# EasyEDA schematic soap-disp-mega.json

## Sheets
1 Power: TITLE: Sheet_2; REV: 1.0; Date: 2021-03-28; Sheet: 1/1; Drawn By: Suresh Kumar Gadi; Company: Your Company
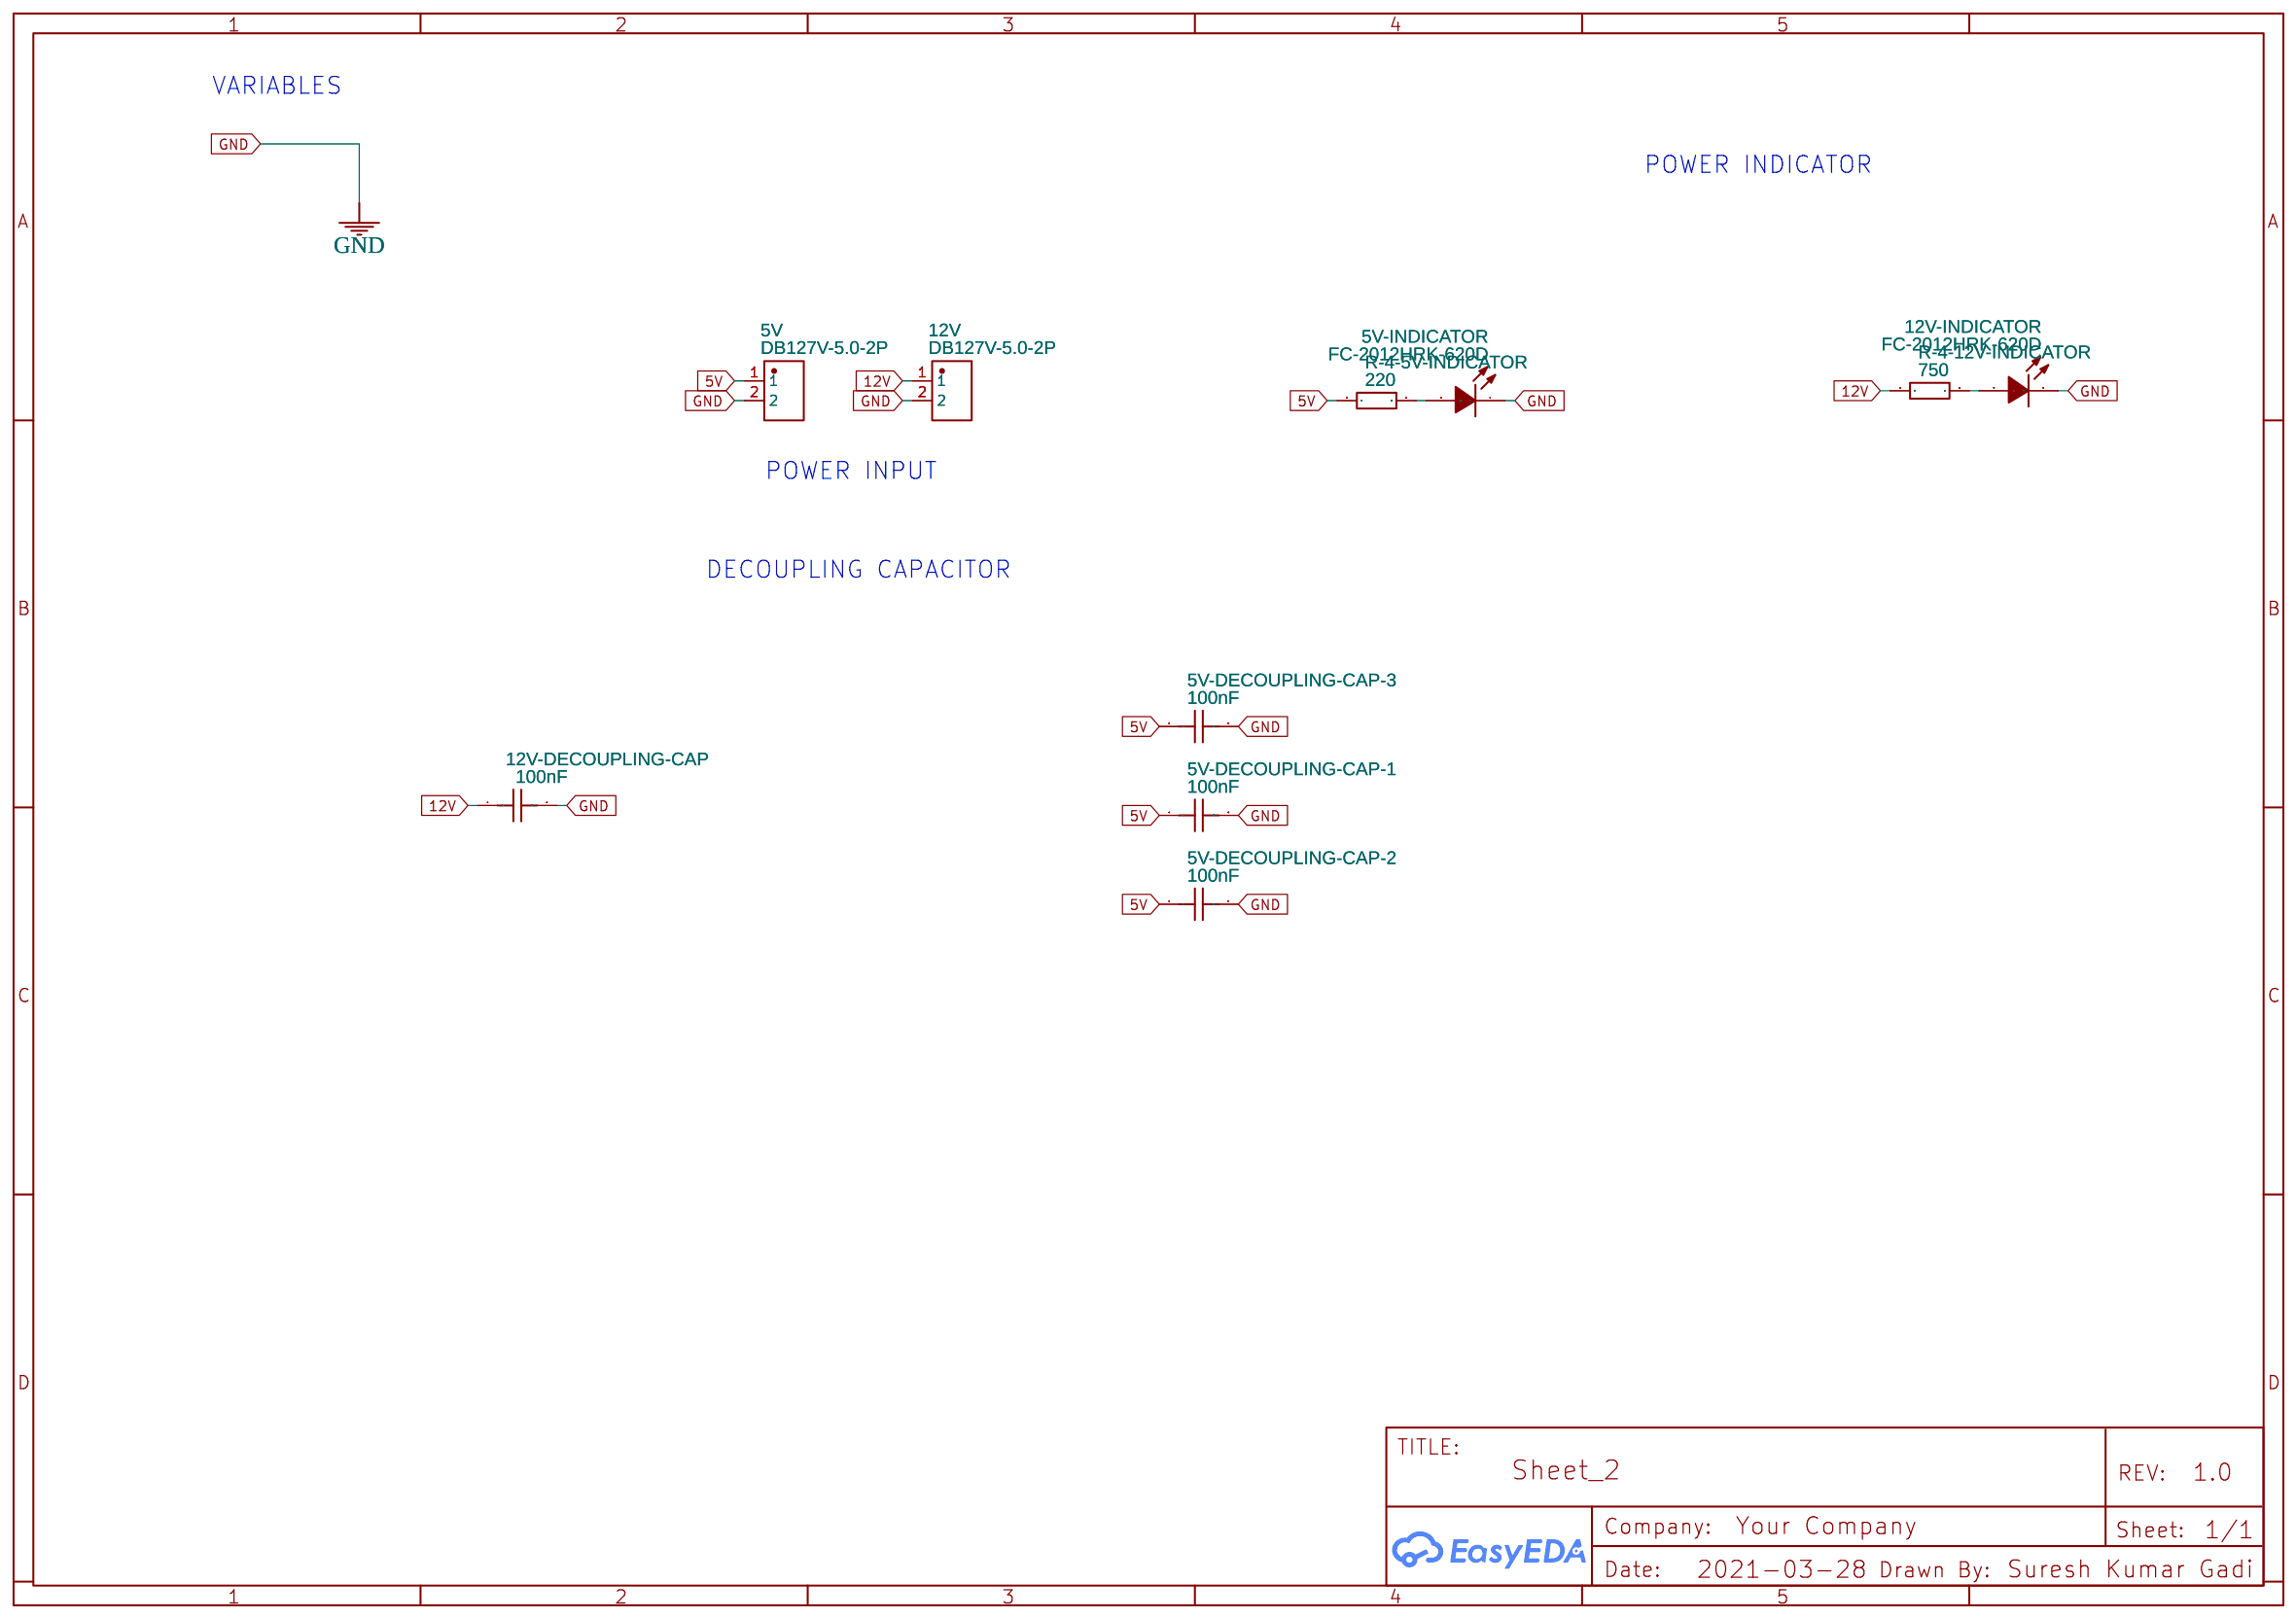
[diagram p0: Power]
2 Computer: TITLE: Sheet_1; Date: 2021-04-07
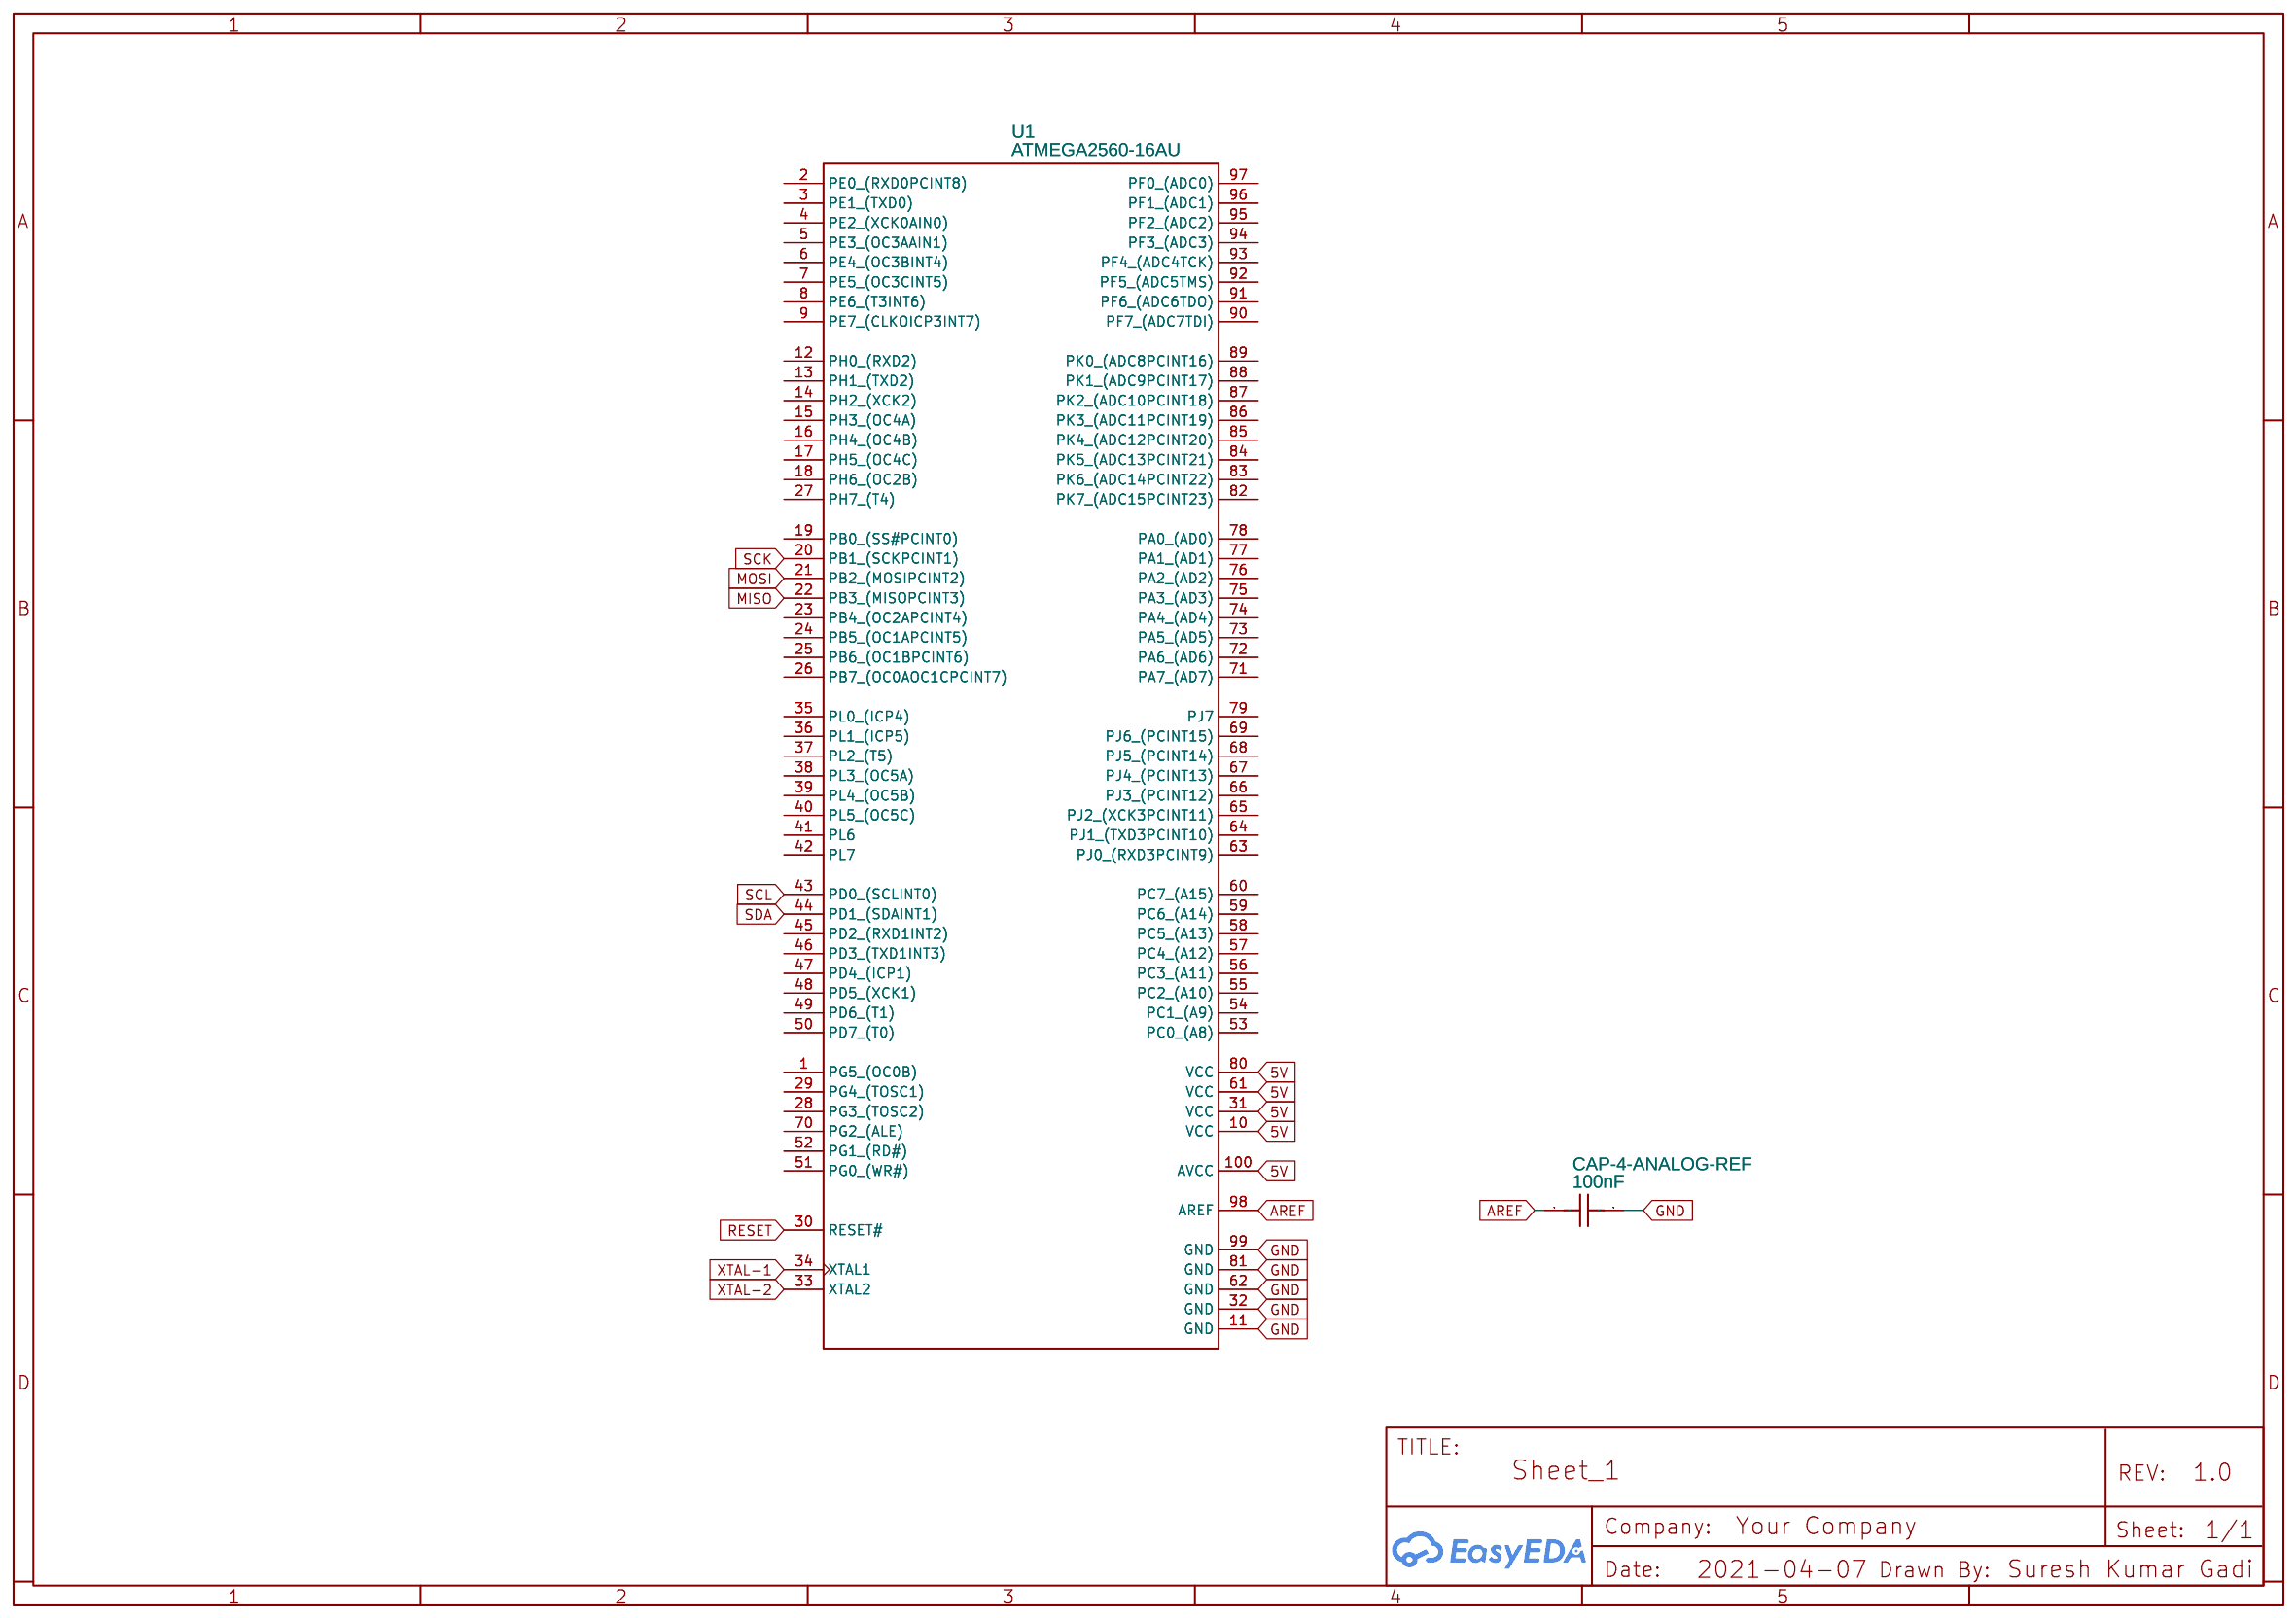
[diagram p1: Computer]
3 Crystal: TITLE: Sheet_1; Date: 2021-04-07
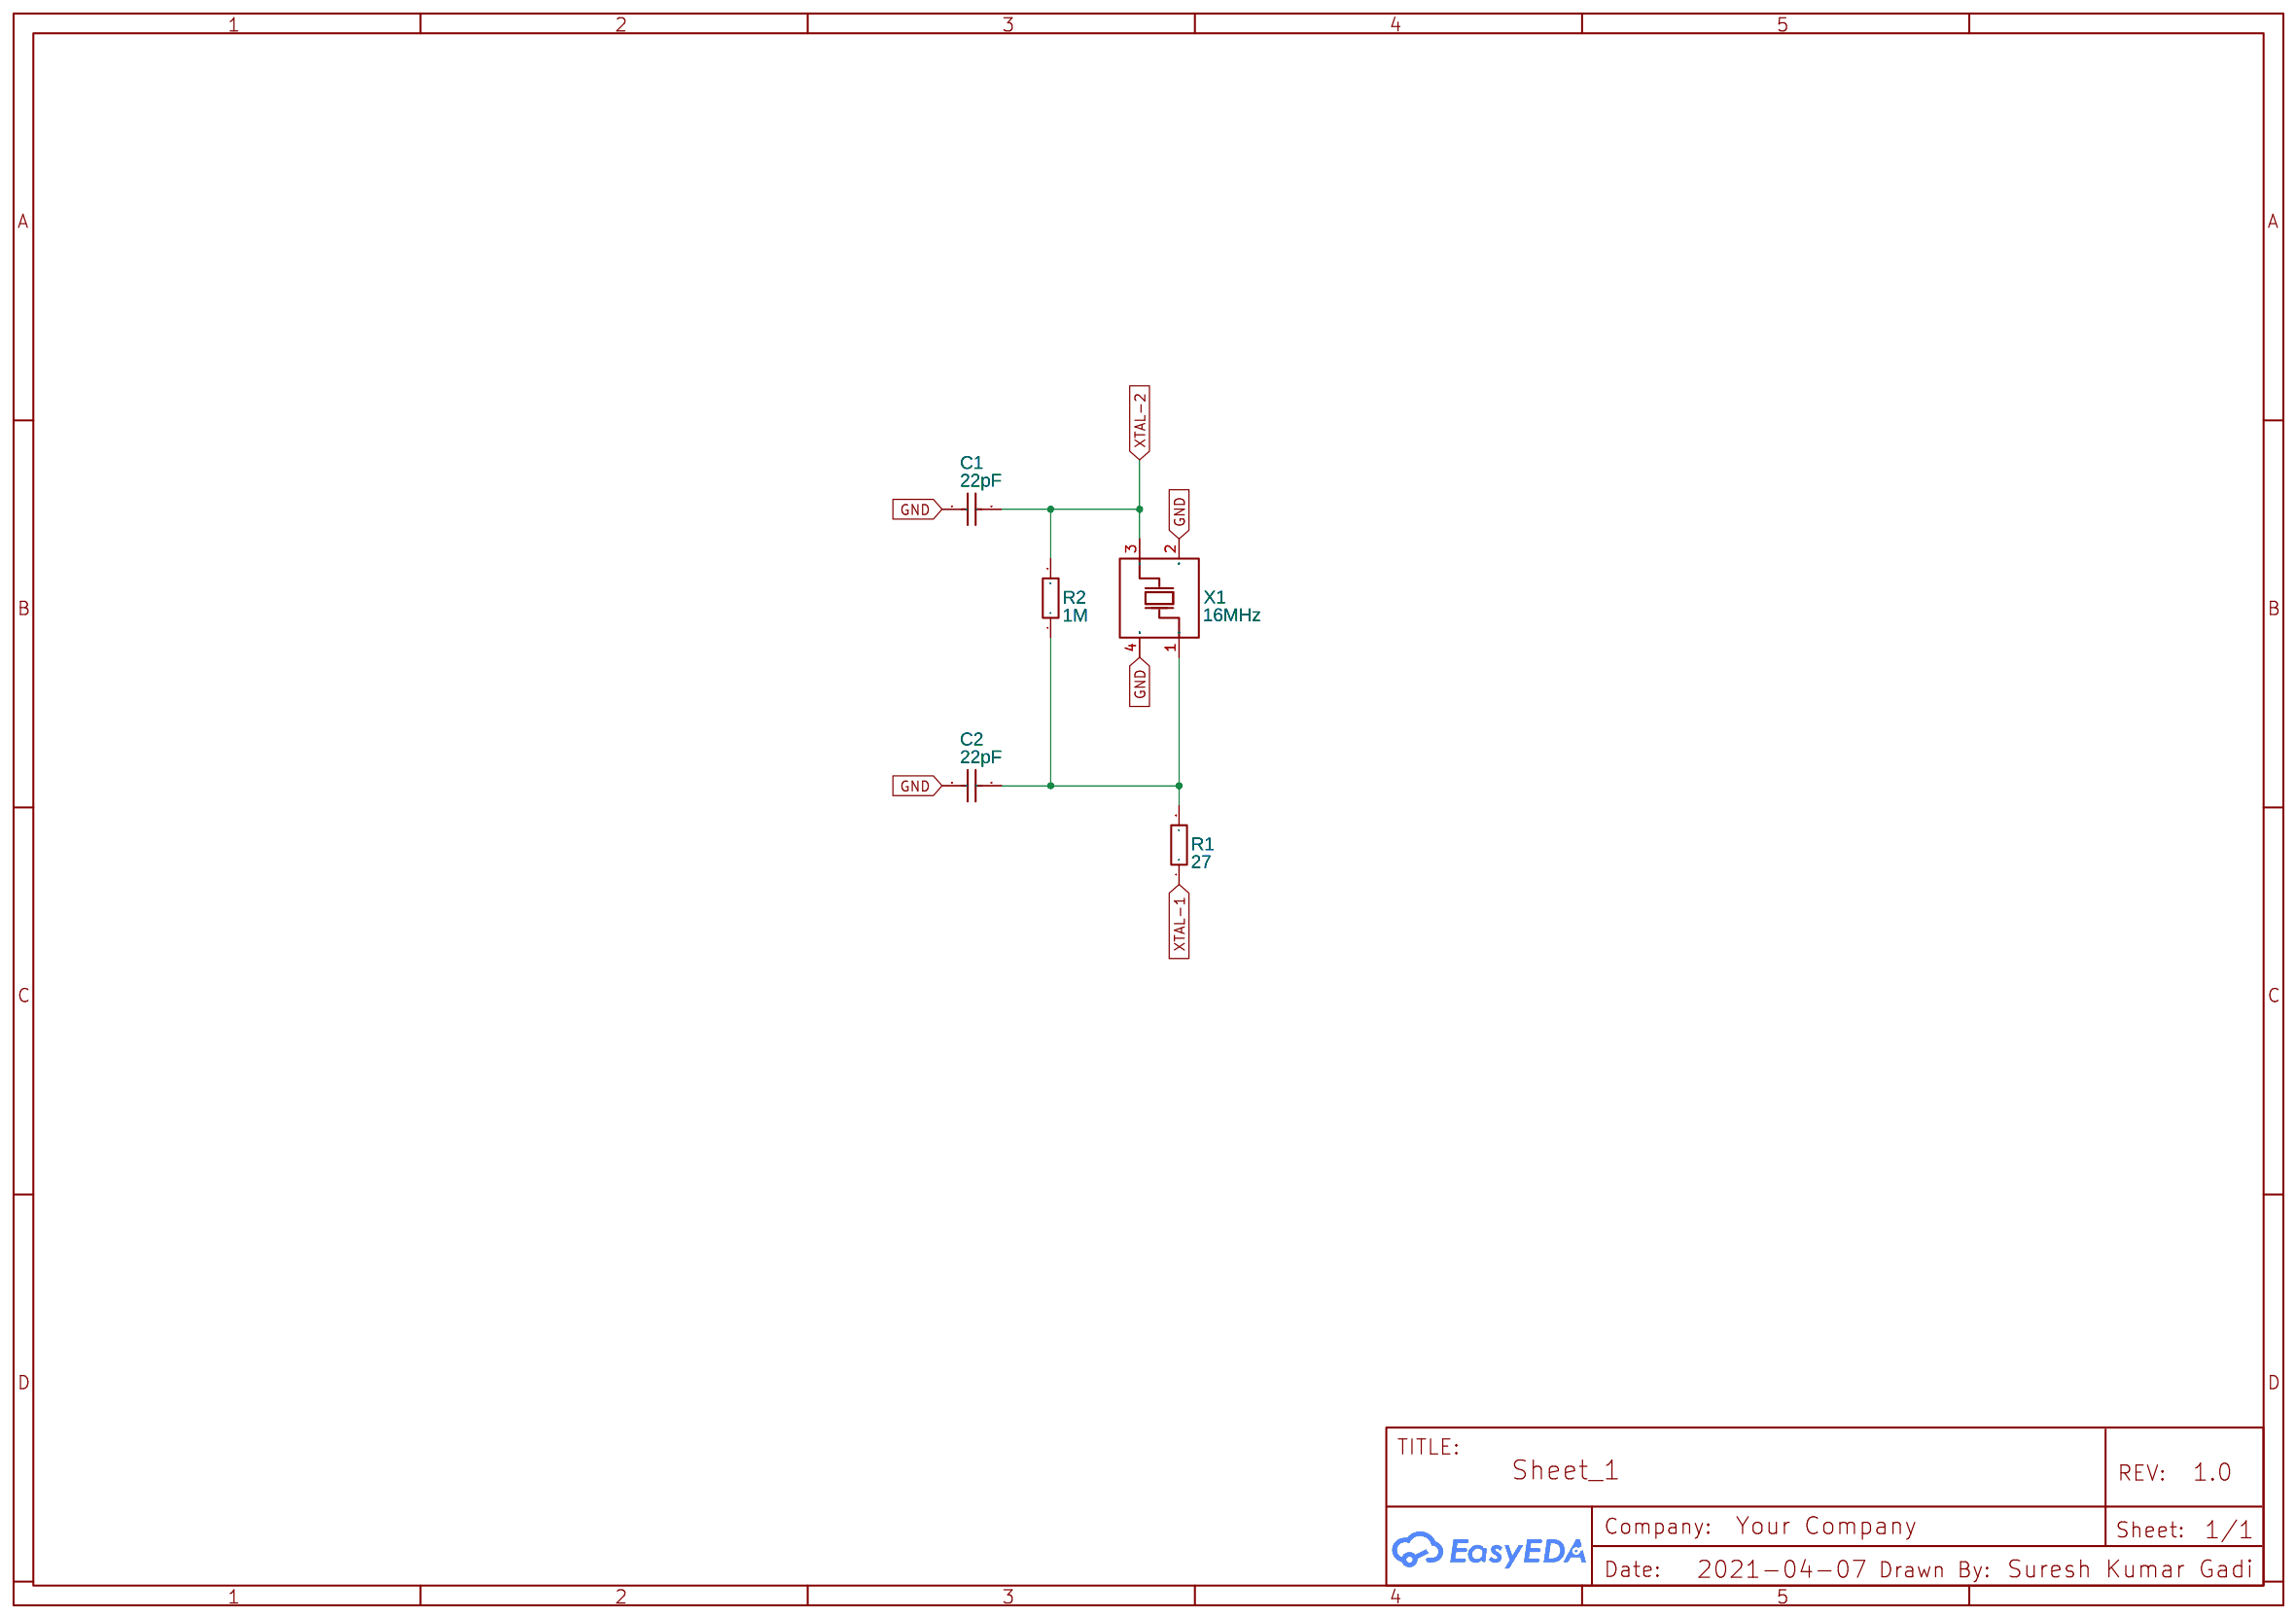
[diagram p2: Crystal]
4 ICSP: TITLE: Sheet_1; Date: 2021-04-07
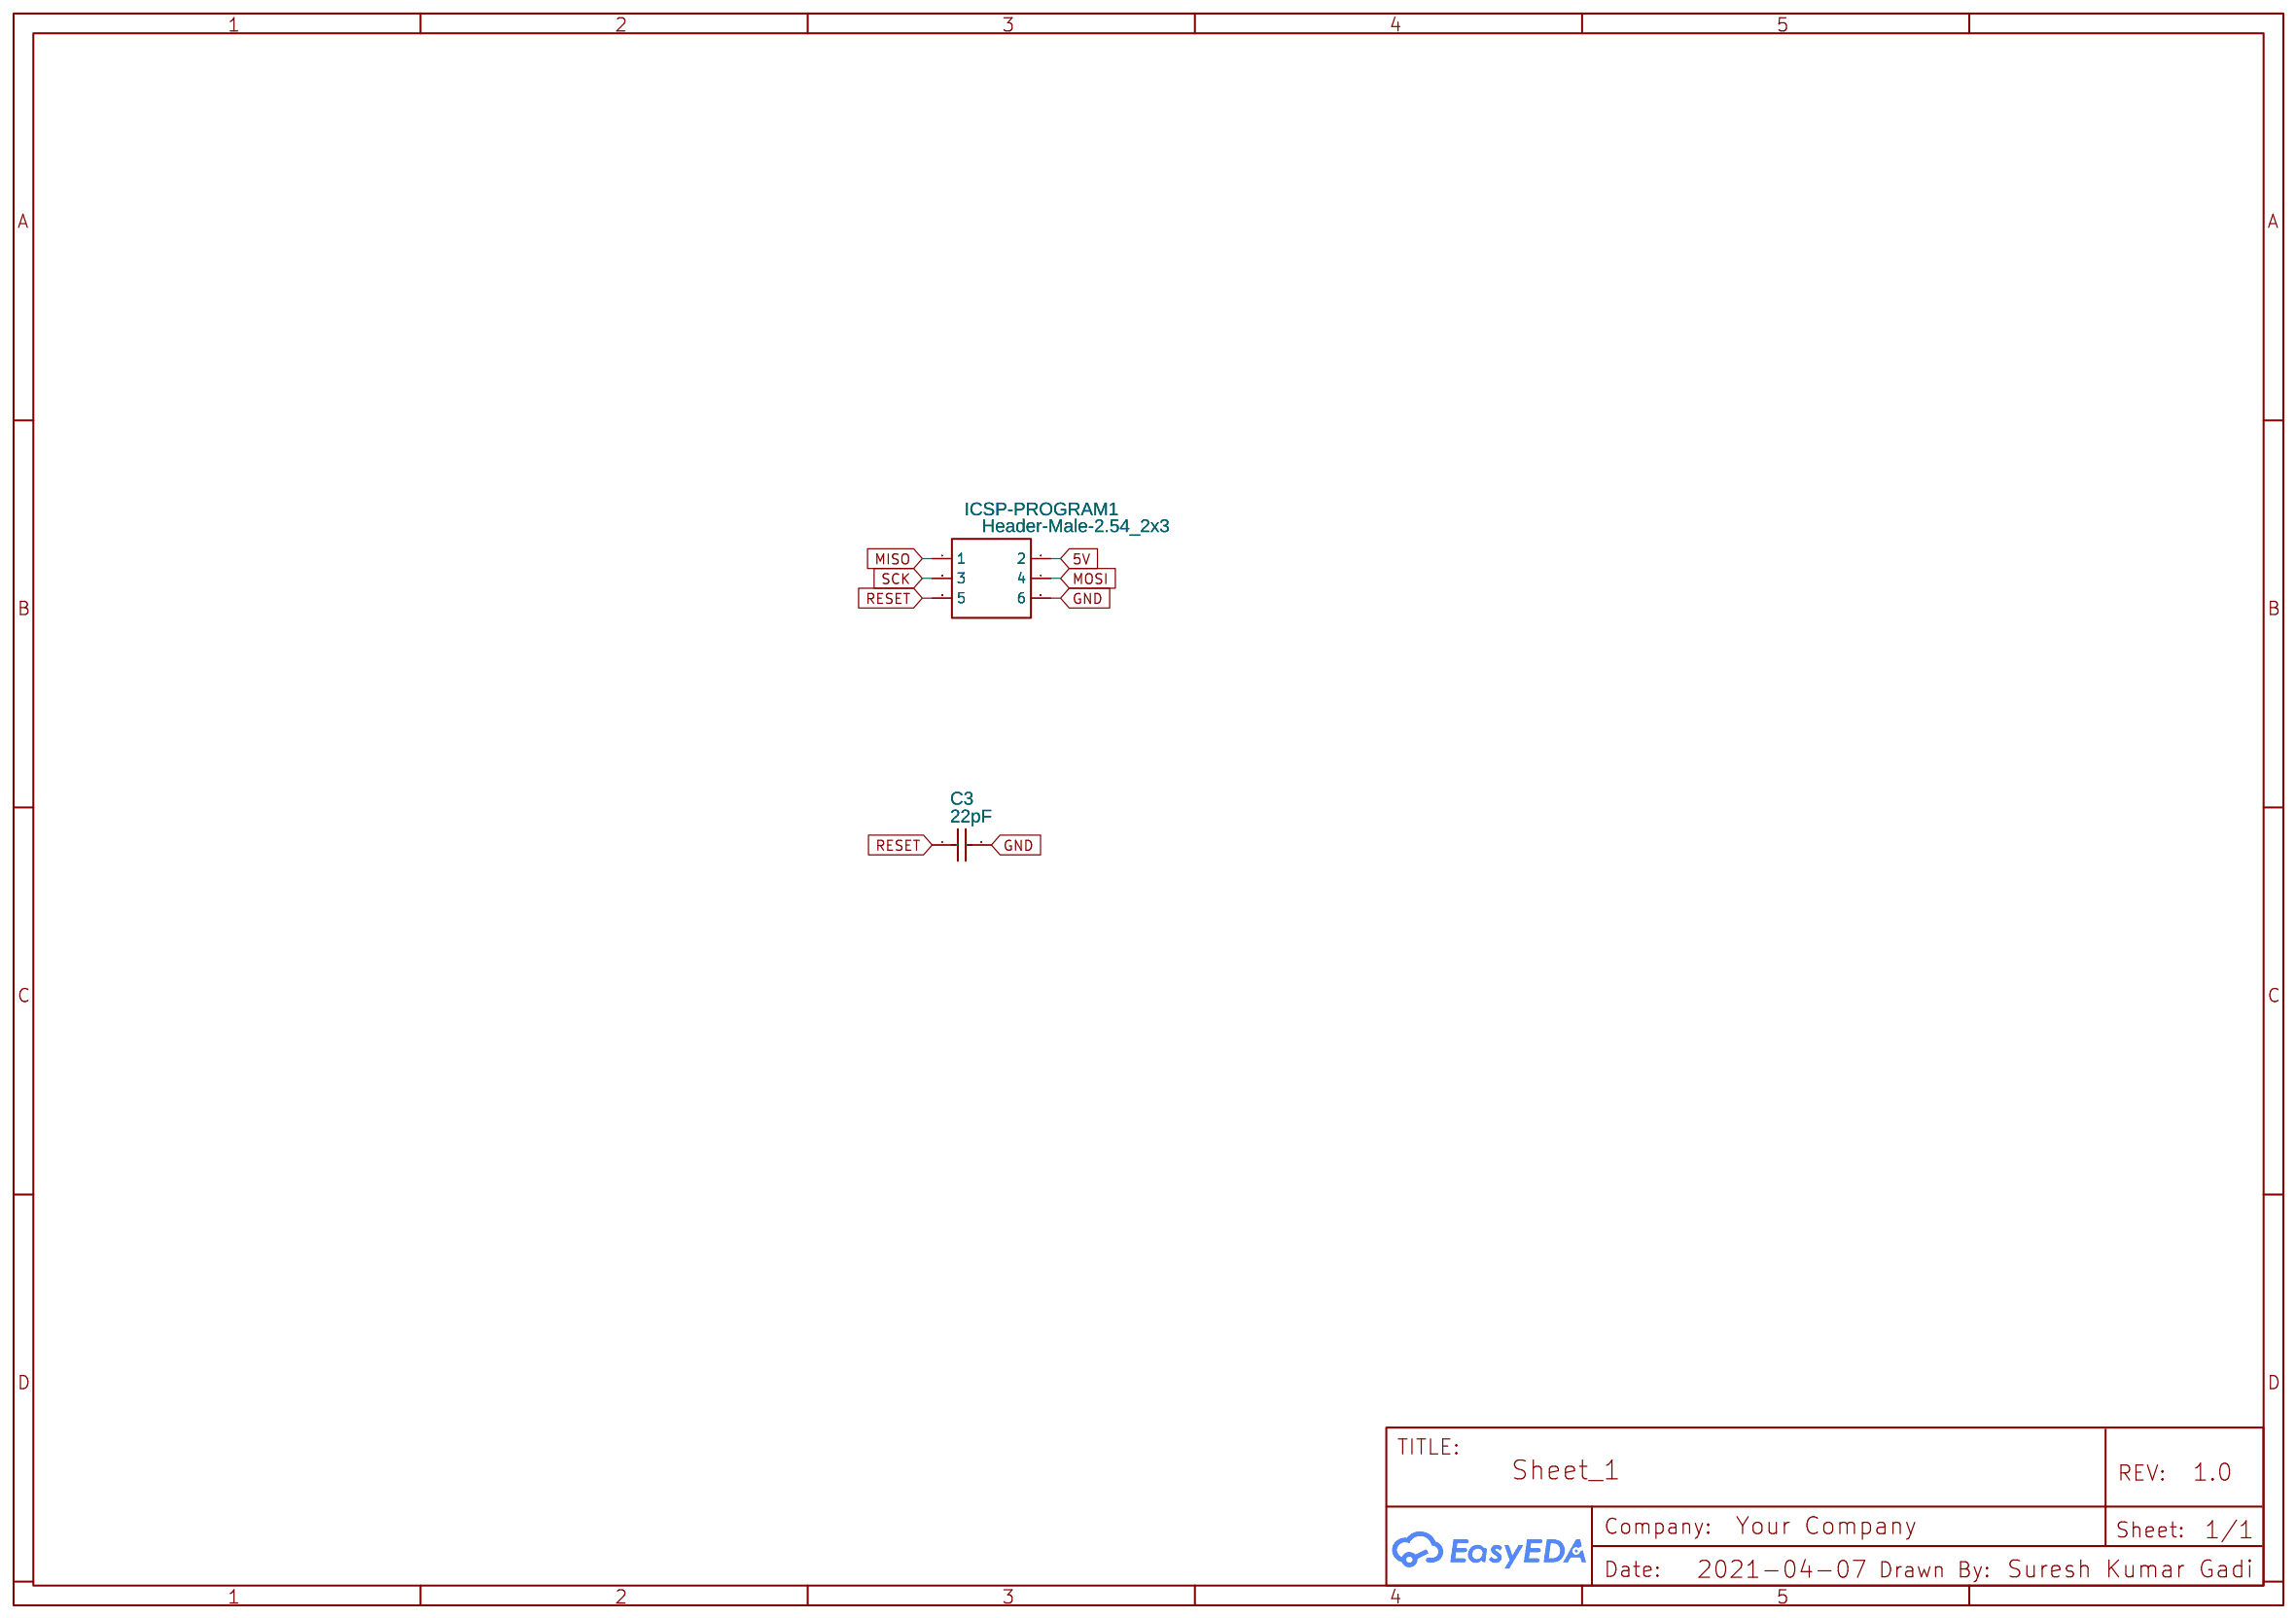
[diagram p3: ICSP]
5 Pull up/down: TITLE: Sheet_1; Date: 2021-04-07
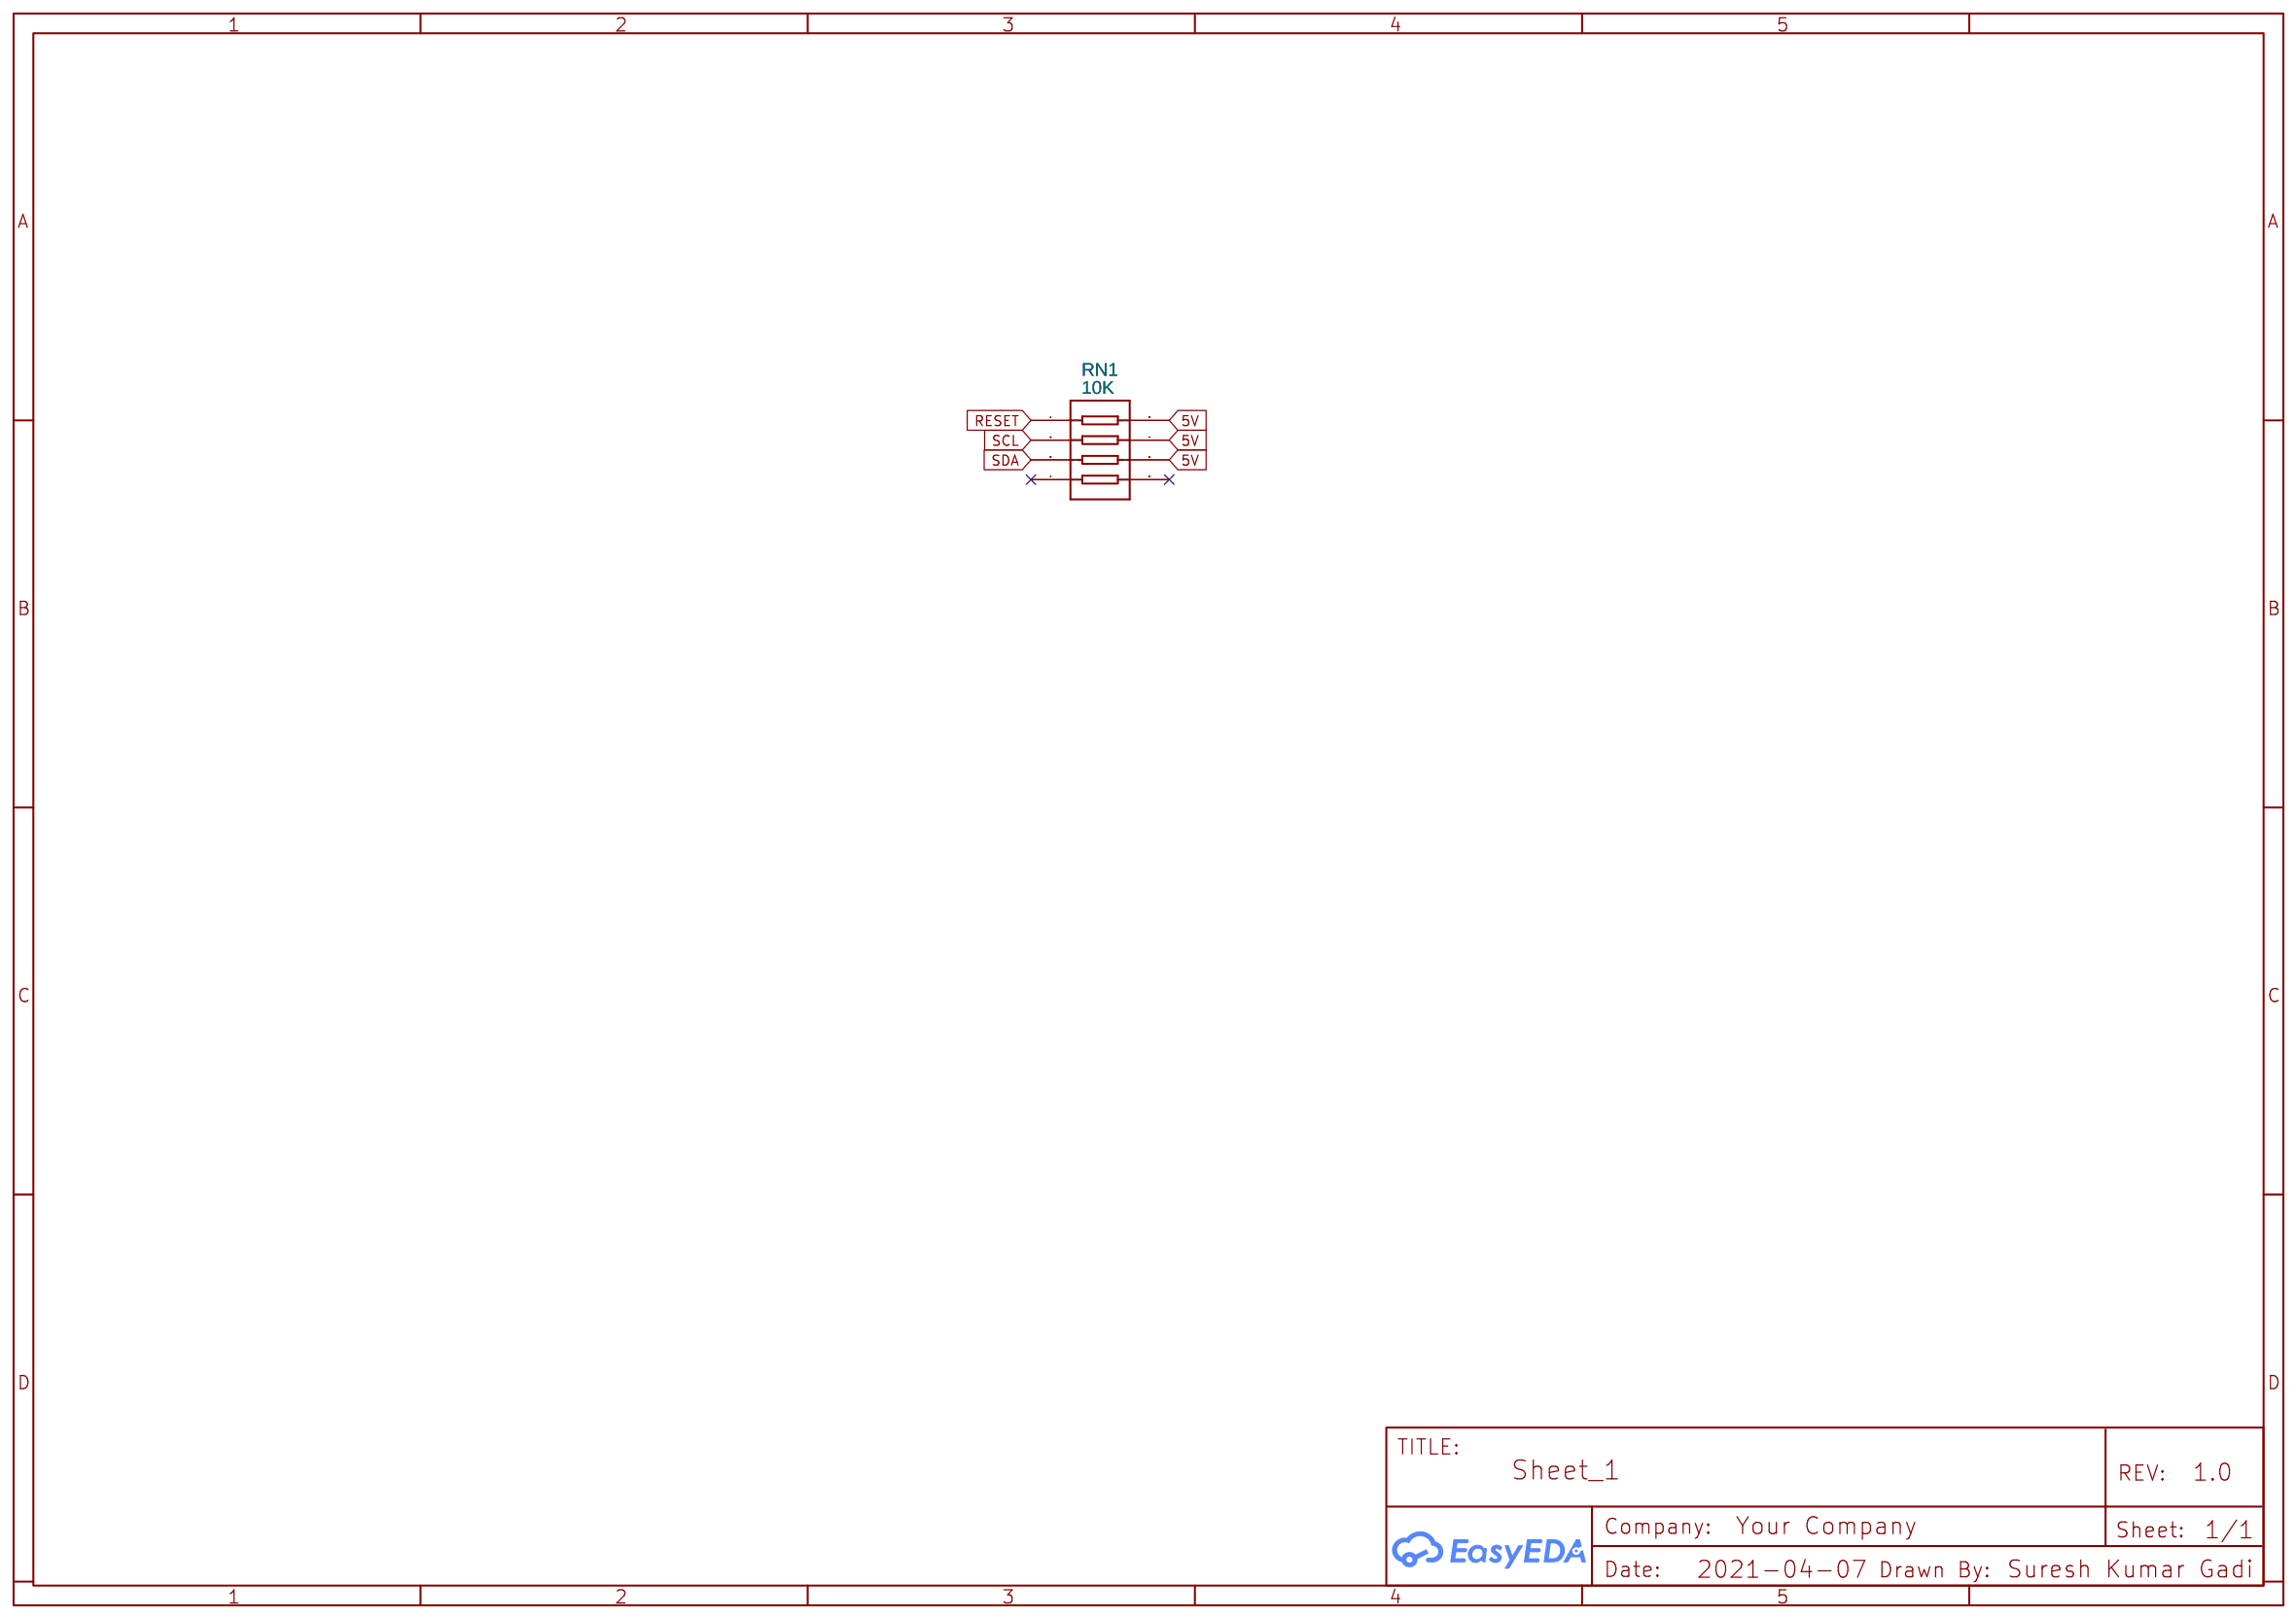
[diagram p4: Pull up/down]
6 Buttons: TITLE: Sheet_1; Date: 2021-04-08
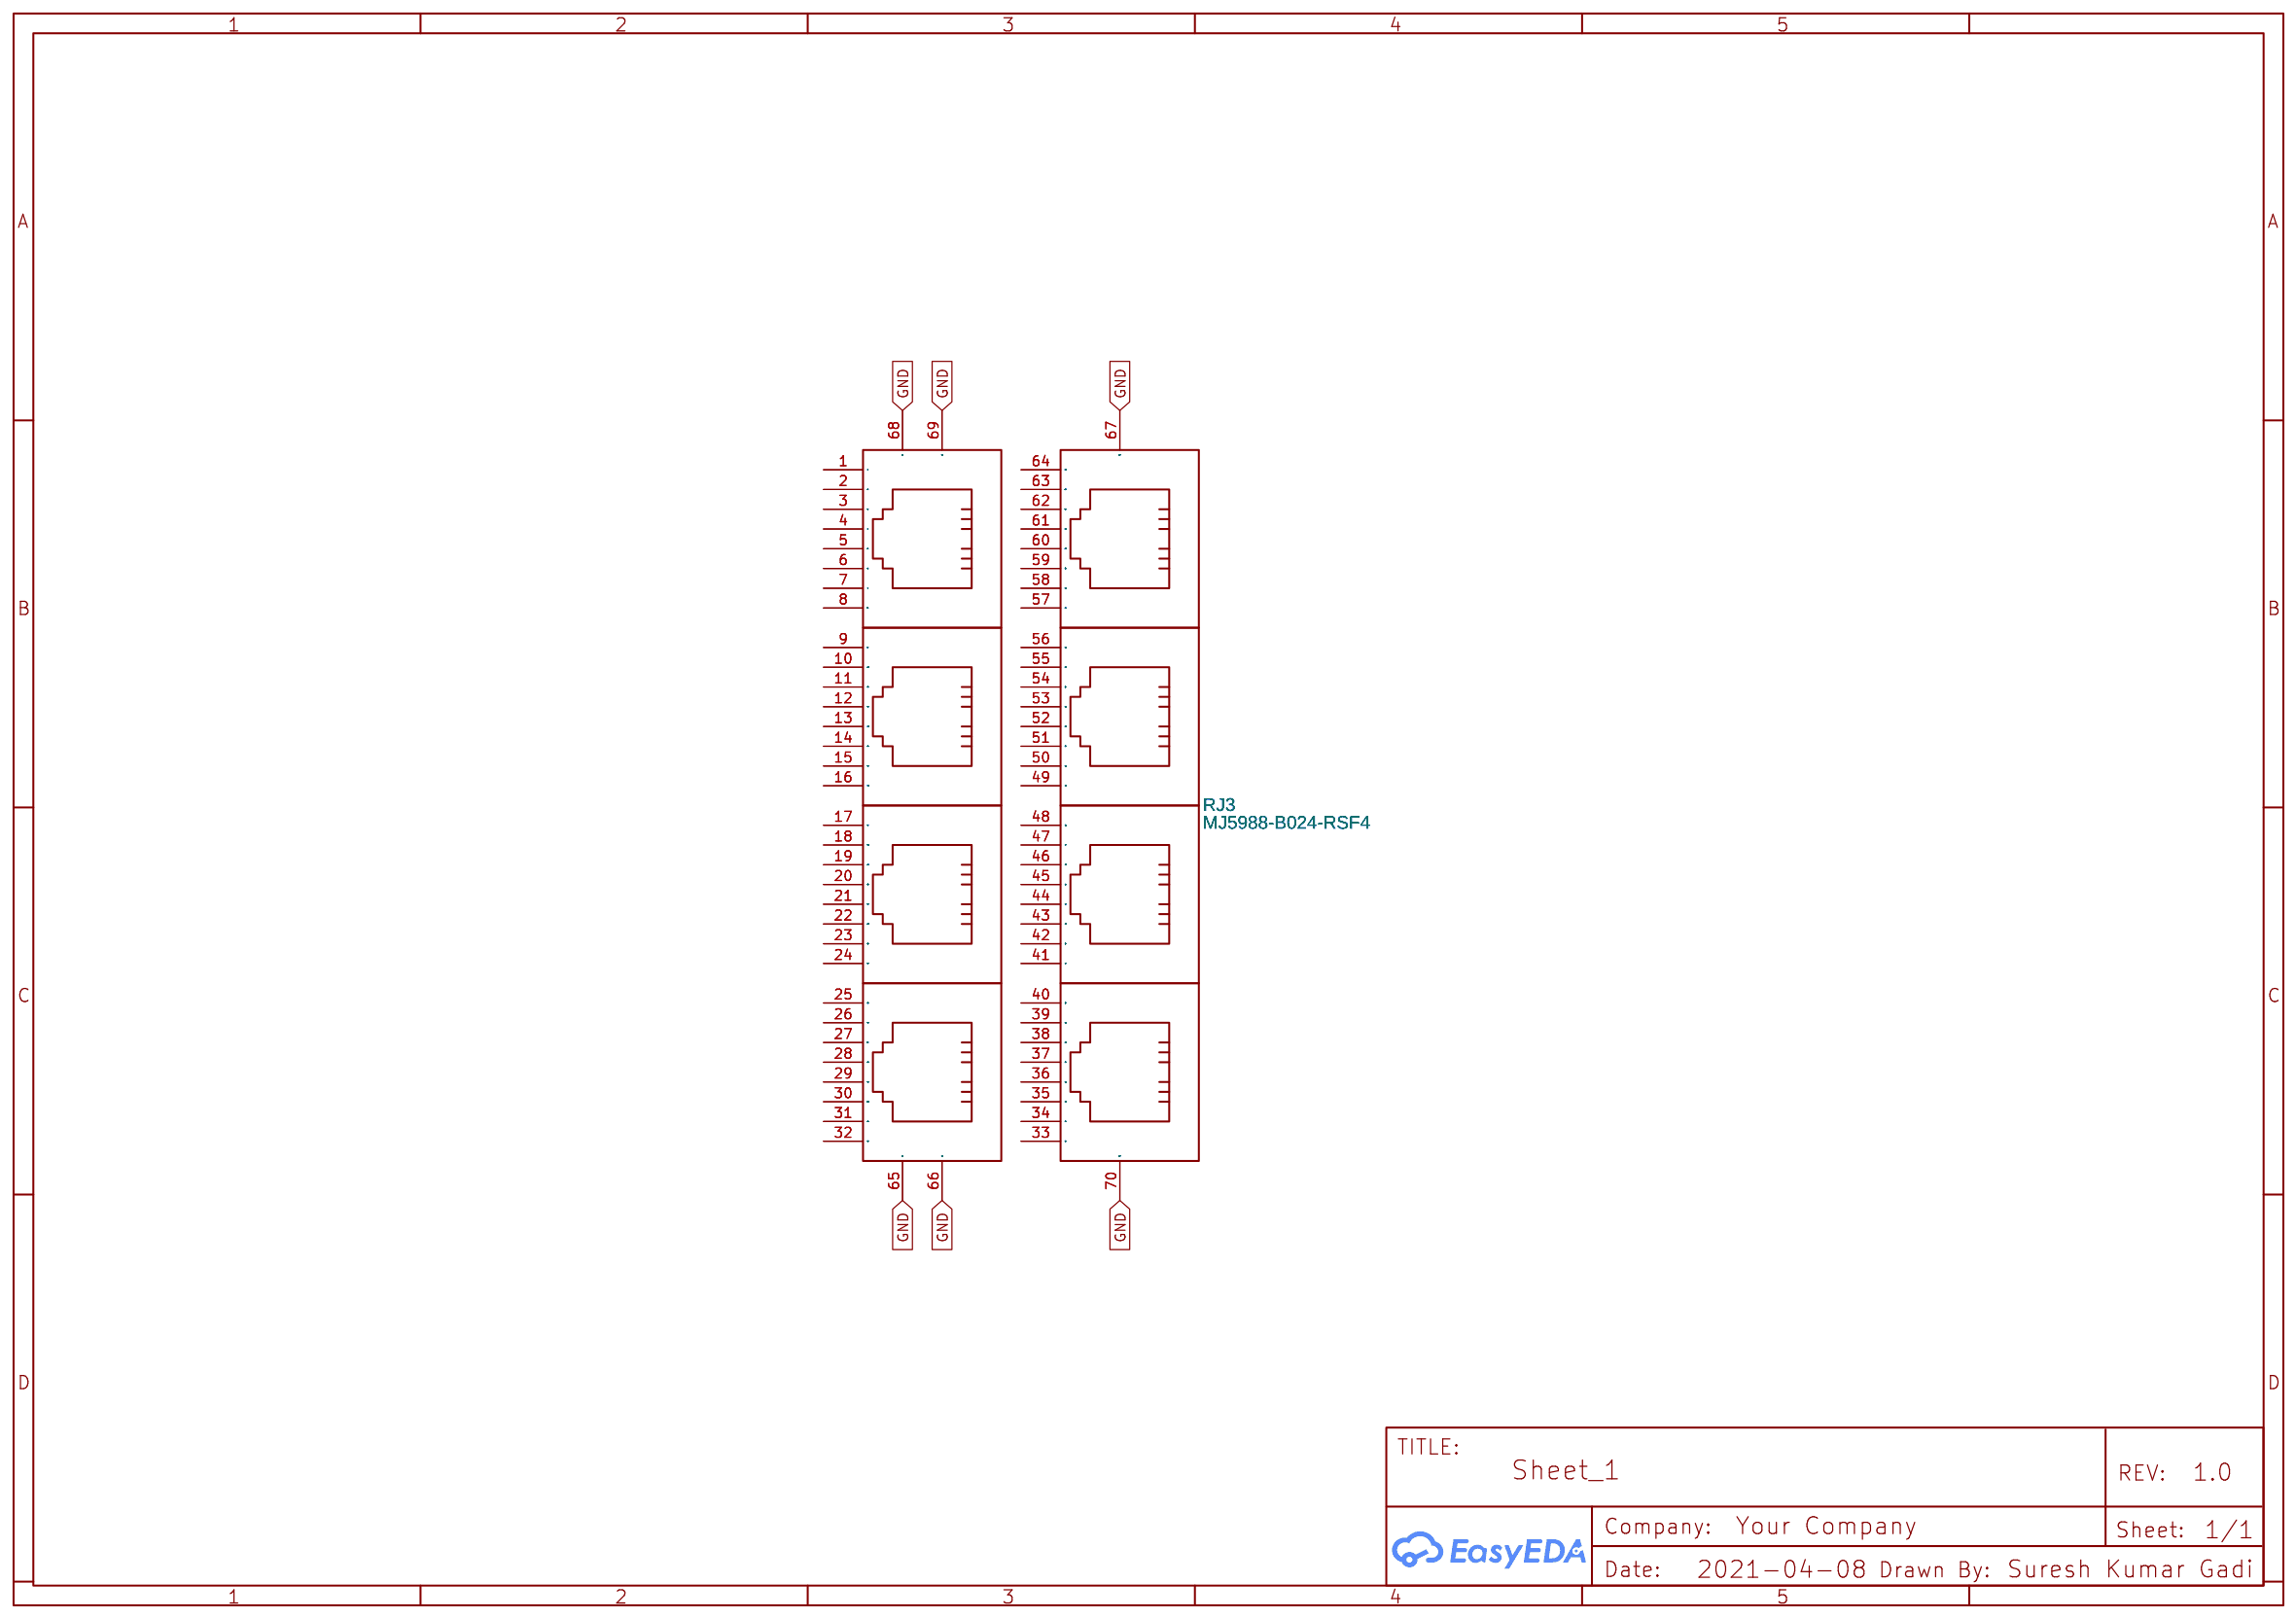
[diagram p5: Buttons]

## Parts
sheet Buttons
RJ3  MJ5988-B024-RSF4  [RJ45-TH_MJ5988-B024-RSF4]
sheet Computer
CAP-4-ANALOG-REF  100nF  [C0603]
U1  ATMEGA2560-16AU  [TQFP-100_L14.0-W14.0-P0.50-LS16.0-BL]
sheet Crystal
C1  22pF  [C0805]
C2  22pF  [C0805]
R1  27  [R0603]
R2  1M  [R0805]
X1  16MHz  [OSC-SMD_4P-L3.2-W2.5-BL]
sheet ICSP
C3  22pF  [C0805]
ICSP-PROGRAM1  Header-Male-2.54_2x3  [HDR-TH_6P-P2.54-V-R2-C3-S2.54]
sheet Power
5V  DB127V-5.0-2P  [CONN-TH_2P-P5.08_L8.5-W10.2]
5V-DECOUPLING-CAP-1  100nF  [C0603]
5V-DECOUPLING-CAP-2  100nF  [C0603]
5V-DECOUPLING-CAP-3  100nF  [C0603]
5V-INDICATOR  FC-2012HRK-620D  [LED0805-RD]
12V  DB127V-5.0-2P  [CONN-TH_2P-P5.08_L8.5-W10.2]
12V-DECOUPLING-CAP  100nF  [C0603]
12V-INDICATOR  FC-2012HRK-620D  [LED0805-RD]
R-4-5V-INDICATOR  220  [R0805]
R-4-12V-INDICATOR  750  [R1206]
sheet Pull up/down
RN1  10K  [RES-ARRAY-SMD_0603-8P-L3.2-W1.6-BL]

## Library data of the parts
RJ3 = MJ5988-B024-RSF4: Supplier: LCSC; Supplier Part: C528693; Manufacturer: Heling; Contributor: LCSC; LCSC Assembly: Yes; SMT Type: Extend; Paste Type: expand
5V-DECOUPLING-CAP-1-5V-DECOUPLING-CAP-3 12V-DECOUPLING-CAP CAP-4-ANALOG-REF = CC0603KRX7R9BB104: Supplier: LCSC; Manufacturer: YAGEO; Supplier Part: C14663; SMT Type: Basic; JLCPCB SMD: Yes; LCSC Assembly: Yes; Paste Type: base
U1 = ATMEGA2560-16AU: Supplier: LCSC; Manufacturer: MICROCHIP; image: //image.lceda.cn/szlcsc/C22460.jpg; Supplier Part: C22460; SMT Type: Extend; JLCPCB SMD: Yes; Paste Type: recommend
C1-C3 = CL21C220JBANNNC: Supplier: LCSC; Manufacturer: SAMSUNG; Supplier Part: C1804; SMT Type: Basic; JLCPCB SMD: Yes; LCSC Assembly: Yes; Paste Type: base
R1 = 0603WAF270JT5E: Supplier: LCSC; Manufacturer: UniOhm; Supplier Part: C25190; SMT Type: Basic; JLCPCB SMD: Yes; LCSC Assembly: Yes; Paste Type: base
R2 = 0805W8F1004T5E: Supplier: LCSC; Manufacturer: UniOhm; Supplier Part: C17514; SMT Type: Basic; JLCPCB SMD: Yes; LCSC Assembly: Yes; Paste Type: base
X1 = X322516MLB4SI: Supplier: LCSC; Manufacturer: YXC; Supplier Part: C13738; SMT Type: Basic; JLCPCB SMD: Yes; LCSC Assembly: Yes; Paste Type: base
ICSP-PROGRAM1 = Header-Male-2.54_2x3: Supplier: LCSC; Manufacturer: BOOMELE; Supplier Part: C65114; LCSC Assembly: Yes; SMT Type: Extend; Paste Type: expand
5V 12V = DB127V-5.0-2P: Supplier: LCSC; Supplier Part: C395885; Manufacturer: DIBO; Contributor: LCSC; LCSC Assembly: Yes; SMT Type: Extend; Paste Type: expand
5V-INDICATOR 12V-INDICATOR = FC-2012HRK-620D: Supplier: LCSC; Manufacturer: NATIONSTAR; image: //image.lceda.cn/szlcsc/C84256.jpg; Supplier Part: C84256; SMT Type: Basic; JLCPCB SMD: Yes; LCSC Assembly: Yes; Paste Type: base
R-4-5V-INDICATOR = 0805W8F2200T5E: Supplier: LCSC; Manufacturer: UniOhm; Supplier Part: C17557; SMT Type: Basic; JLCPCB SMD: Yes; LCSC Assembly: Yes; Paste Type: base
R-4-12V-INDICATOR = 1206W4F7500T5E: Supplier: LCSC; Manufacturer: UniOhm; Supplier Part: C17985; SMT Type: Basic; JLCPCB SMD: Yes; LCSC Assembly: Yes; Paste Type: base
RN1 = 4D03WGJ0103T5E: Supplier: LCSC; Manufacturer: UniOhm; Supplier Part: C29718; SMT Type: Basic; JLCPCB SMD: Yes; LCSC Assembly: Yes; Paste Type: base

## Nets
5V: 5V.1 5V-DECOUPLING-CAP-1.1 5V-DECOUPLING-CAP-2.1 5V-DECOUPLING-CAP-3.1 ICSP-PROGRAM1.2 R-4-5V-INDICATOR.1 RN1.6 RN1.7 RN1.8 U1.10(VCC) U1.31(VCC) U1.61(VCC) U1.80(VCC) U1.100(AVCC)
12V: 12V.1 12V-DECOUPLING-CAP.1 R-4-12V-INDICATOR.1
GND: 5V.2 5V-DECOUPLING-CAP-1.2 5V-DECOUPLING-CAP-2.2 5V-DECOUPLING-CAP-3.2 5V-INDICATOR.1(-) 12V.2 12V-DECOUPLING-CAP.2 12V-INDICATOR.1(-) C1.1 C2.1 C3.2 CAP-4-ANALOG-REF.2 ICSP-PROGRAM1.6 RJ3.65 RJ3.66 RJ3.67 RJ3.68 RJ3.69 RJ3.70 U1.11(GND) U1.32(GND) U1.62(GND) U1.81(GND) U1.99(GND) X1.2(GND) X1.4(GND)
AREF: CAP-4-ANALOG-REF.1 U1.98(AREF)
MISO: ICSP-PROGRAM1.1 U1.22(PB3 (MISOPCINT3))
MOSI: ICSP-PROGRAM1.4 U1.21(PB2 (MOSIPCINT2))
RESET: C3.1 ICSP-PROGRAM1.5 RN1.1 U1.30(RESET#)
SCK: ICSP-PROGRAM1.3 U1.20(PB1 (SCKPCINT1))
SCL: RN1.2 U1.43(PD0 (SCLINT0))
SDA: RN1.3 U1.44(PD1 (SDAINT1))
XTAL-1: R1.1 U1.34(XTAL1)
XTAL-2: C1.2 R2.2 U1.33(XTAL2) X1.3(OSC2)
Net-(5V-INDICATOR-2): 5V-INDICATOR.2(+) R-4-5V-INDICATOR.2
Net-(12V-INDICATOR-2): 12V-INDICATOR.2(+) R-4-12V-INDICATOR.2
Net-(C2-2): C2.2 R1.2 R2.1 X1.1(OSC1)

Not connected (* = marked no-connect by the designer): RJ3 1 2 3 4 5 6 7 8 9 10 11 12 13 14 15 16 17 18 19 20 21 22 23 24 25 26 27 28 29 30 31 32 33 34 35 36 37 38 39 40 41 42 43 44 45 46 47 48 49 50 51 52 53 54 55 56 57 58 59 60 61 62 63 64; RN1 4* 5*; U1 1(PG5 (OC0B)) 2(PE0 (RXD0PCINT8)) 3(PE1 (TXD0)) 4(PE2 (XCK0AIN0)) 5(PE3 (OC3AAIN1)) 6(PE4 (OC3BINT4)) 7(PE5 (OC3CINT5)) 8(PE6 (T3INT6)) 9(PE7 (CLKOICP3INT7)) 12(PH0 (RXD2)) 13(PH1 (TXD2)) 14(PH2 (XCK2)) 15(PH3 (OC4A)) 16(PH4 (OC4B)) 17(PH5 (OC4C)) 18(PH6 (OC2B)) 19(PB0 (SS#PCINT0)) 23(PB4 (OC2APCINT4)) 24(PB5 (OC1APCINT5)) 25(PB6 (OC1BPCINT6)) 26(PB7 (OC0AOC1CPCINT7)) 27(PH7 (T4)) 28(PG3 (TOSC2)) 29(PG4 (TOSC1)) 35(PL0 (ICP4)) 36(PL1 (ICP5)) 37(PL2 (T5)) 38(PL3 (OC5A)) 39(PL4 (OC5B)) 40(PL5 (OC5C)) 41(PL6) 42(PL7) 45(PD2 (RXD1INT2)) 46(PD3 (TXD1INT3)) 47(PD4 (ICP1)) 48(PD5 (XCK1)) 49(PD6 (T1)) 50(PD7 (T0)) 51(PG0 (WR#)) 52(PG1 (RD#)) 53(PC0 (A8)) 54(PC1 (A9)) 55(PC2 (A10)) 56(PC3 (A11)) 57(PC4 (A12)) 58(PC5 (A13)) 59(PC6 (A14)) 60(PC7 (A15)) 63(PJ0 (RXD3PCINT9)) 64(PJ1 (TXD3PCINT10)) 65(PJ2 (XCK3PCINT11)) 66(PJ3 (PCINT12)) 67(PJ4 (PCINT13)) 68(PJ5 (PCINT14)) 69(PJ6 (PCINT15)) 70(PG2 (ALE)) 71(PA7 (AD7)) 72(PA6 (AD6)) 73(PA5 (AD5)) 74(PA4 (AD4)) 75(PA3 (AD3)) 76(PA2 (AD2)) 77(PA1 (AD1)) 78(PA0 (AD0)) 79(PJ7) 82(PK7 (ADC15PCINT23)) 83(PK6 (ADC14PCINT22)) 84(PK5 (ADC13PCINT21)) 85(PK4 (ADC12PCINT20)) 86(PK3 (ADC11PCINT19)) 87(PK2 (ADC10PCINT18)) 88(PK1 (ADC9PCINT17)) 89(PK0 (ADC8PCINT16)) 90(PF7 (ADC7TDI)) 91(PF6 (ADC6TDO)) 92(PF5 (ADC5TMS)) 93(PF4 (ADC4TCK)) 94(PF3 (ADC3)) 95(PF2 (ADC2)) 96(PF1 (ADC1)) 97(PF0 (ADC0))

## Notes on the sheets
sheet 1
- VARIABLES
- POWER INDICATOR
- POWER INPUT
- DECOUPLING CAPACITOR
